# EAGLE schematic Antenna Board v4.1 (EAGLE 9.6.2)
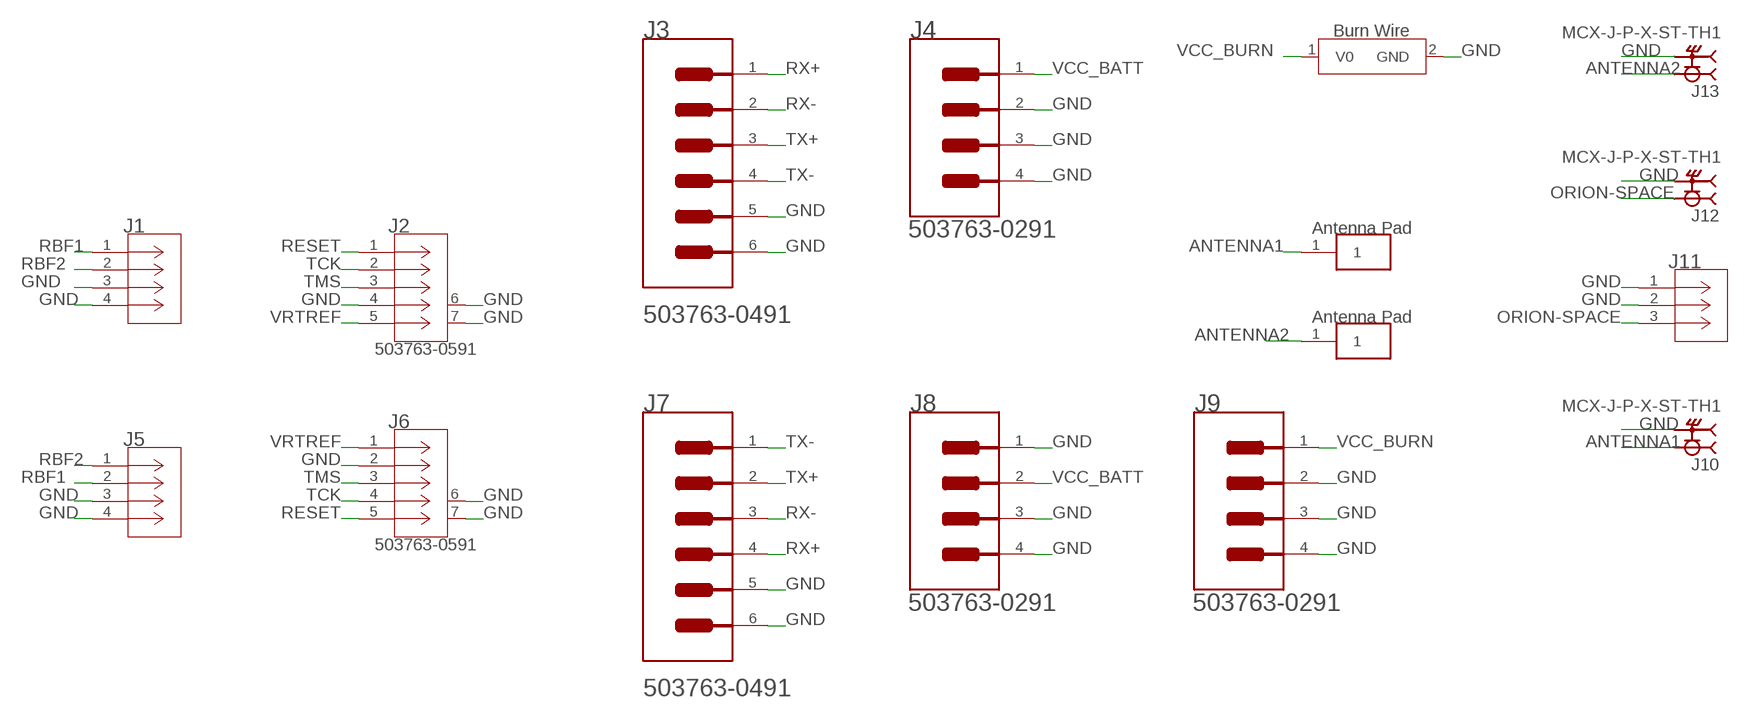
[diagram p0: schematic, sheet 1]

## Parts
J1  5037630291  [CON_5037630291]
J2  503763-0591  [CONN_5037630591_MOL]
J3  MOLEX_503763-0491MOLEX_503763-0491_0_0  [MOLEX_503763-0491_0]
J4  MOLEX_503763-0291MOLEX_503763-0291_0_0  [MOLEX_503763-0291_0]
J5  5037630291  [CON_5037630291]
J6  503763-0591  [CONN_5037630591_MOL]
J7  MOLEX_503763-0491MOLEX_503763-0491_0_0  [MOLEX_503763-0491_0]
J8  MOLEX_503763-0291MOLEX_503763-0291_0_0  [MOLEX_503763-0291_0]
J9  MOLEX_503763-0291MOLEX_503763-0291_0_0  [MOLEX_503763-0291_0]
J10  MCX-J-P-X-ST-TH1  [SAMTEC_MCX-J-P-X-ST-TH1]
J11  U.FL-R-SMT-1(01)  [CONN_-SMT-1(01)]
J12  MCX-J-P-X-ST-TH1  [SAMTEC_MCX-J-P-X-ST-TH1]
J13  MCX-J-P-X-ST-TH1  [SAMTEC_MCX-J-P-X-ST-TH1]
U$1  ANTENNA_PAD+HOLES  [ANTENNA_PAD+HOLES]
U$2  ANTENNA_PAD+HOLES  [ANTENNA_PAD+HOLES]
U$3  BURNWIRE  [BURNWIRE]

## Nets
ANTENNA1: J10.1 U$1.1
ANTENNA2: J13.1 U$2.1
GND: J1.3 J1.4 J2.4 J2.6 J2.7 J3.5(MNT_1) J3.6(MNT_2) J4.2 J4.3(MNT_1) J4.4(MNT_2) J5.3 J5.4 J6.2 J6.6 J6.7 J7.5(MNT_1) J7.6(MNT_2) J8.1 J8.3(MNT_1) J8.4(MNT_2) J9.2 J9.3(MNT_1) J9.4(MNT_2) J10.S1 J10.S2 J10.S3 J10.S4 J11.1 J11.2 J12.S1 J12.S2 J12.S3 J12.S4 J13.S1 J13.S2 J13.S3 J13.S4 U$3.2(GND)
ORION-SPACE: J11.3 J12.1
RBF1: J1.1 J5.2
RBF2: J1.2 J5.1
RESET: J2.1 J6.5
RX+: J3.1 J7.4
RX-: J3.2 J7.3
TCK: J2.2 J6.4
TMS: J2.3 J6.3
TX+: J3.3 J7.2
TX-: J3.4 J7.1
VCC_BATT: J4.1 J8.2
VCC_BURN: J9.1 U$3.1(V0)
VRTREF: J2.5 J6.1

## Library data of the parts
J1 J5 = Molex_503763-0291:5037630291; BUILT_BY: Molex_Team; COPYRIGHT: Copyright (C) 2018 Accelerated Designs. All rights reserved; MANUFACTURER_PART_NUMBER: 5037630291; SOURCELIBRARY: Add_to_database_2021-03-17; VENDOR: Molex Connector Corporation
J2 J6 = Molex - 503763-0591:503763-0591; BUILT_BY: EMA_Cory; COPYRIGHT: Copyright (C) 2018 Accelerated Designs. All rights reserved; DATASHEET: https://www.molex.com/pdm_docs/sd/5037630591_sd.pdf; MANUFACTURER_PART_NUMBER: 503763-0591; SOURCELIBRARY: Add_to_database_2020-12-14; VENDOR: Molex Connector Corporation
J3 J7 = Molex - 503763-0491:MOLEX_503763-0491: Wire-To-Board Connector, Pico-Lock 503763 Series, Surface Mount, Header, 4 Contacts, 1 mm; AUTOMOTIVE: No; CENTROID_NOT_SPECIFIED: No; CONN_GENDER: Male; CONN_ORIENTATION: Right Angle; CONTACT_MATERIAL: Gold,Nickel; CURRENT_RATING: 1.5A; DATASHEET: https://www.molex.com/webdocs/datasheets/pdf/en-us/5037630491_PCB_HEADERS.pdf; DEVICE_CLASS_L1: Connectors; DEVICE_CLASS_L2: Headers and Wire Housings; DEVICE_CLASS_L3: unset; DIGIKEY_DESCRIPTION: CONN HEADER 1MM R/A 4CKT; DIGIKEY_PART_NUMBER: WM10655CT-ND; FOOTPRINT_URL: https://www.molex.com/pdm_docs/sd/5037630491_sd.pdf; FOOTPRINT_VARIANT_NAME_0: Recommended_Land_Pattern; HEIGHT: 1.7mm; LEAD_FREE: Yes; MF: Molex; MFG_PACKAGE_IDENT: 503763-0491; MFG_PACKAGE_IDENT_DATE: 0; MFG_PACKAGE_IDENT_REV: 0; MOUSER_PART_NUMBER: 538-503763-0491; MPN: 503763-0491; NUMBER_OF_CONTACTS: 4; NUMBER_OF_ROWS: 1; PACKAGE: HDR4; PITCH: 1mm; PREFIX: J; ROHS: Yes; TEMPERATURE_RANGE_HIGH: +105°C; TEMPERATURE_RANGE_LOW: -40°C; VERIFICATION_VERSION: 0.0.0.1; VOLTAGE_RATING: 150V
J4 J8 J9 = Molex - 503763-0291:MOLEX_503763-0291: 2 Positions Header Connector 0.039" (1.00mm) Surface Mount, Right Angle Gold; CENTROID_NOT_SPECIFIED: No; DATASHEET: http://www.molex.com/pdm_docs/sd/5037630291_sd.pdf; DIGIKEY_DESCRIPTION: CONN HEADER 1MM R/A 2CKT; DIGIKEY_PART_NUMBER: WM10654CT-ND; LEAD_FREE: yes; MF: Molex; MOUSER_PART_NUMBER: 538-503763-0291; MPN: 503763-0291; PACKAGE: HDR02; PREFIX: J; ROHS: yes; TEMPERATURE_RANGE_HIGH: +105°C; TEMPERATURE_RANGE_LOW: -40°C
J10 J12 J13 = MCX-J-P-X-ST-TH1:MCX-J-P-X-ST-TH1: 50 Ohm MCX Jack or Plug, Through-hole; DESCRIPTION: MCX Connector Jack, Female Socket 50Ohm Through Hole Solder; DIGI-KEY_PART_NUMBER: SAM8944-ND; MF: Samtec; MP: MCX-J-P-H-ST-TH1; PACKAGE: None; PURCHASE-URL: https://pricing.snapeda.com/search/part/MCX-J-P-H-ST-TH1/?ref=eda
J11 = U.FL-R-SMT-1(01):U.FL-R-SMT-1(01); BUILT_BY: EMA_Matt; COPYRIGHT: Copyright (C) 2018 Accelerated Designs. All rights reserved; MANUFACTURER_PART_NUMBER: U.FL-R-SMT-1(01); SOURCELIBRARY: Hirose_12_20_2019; VENDOR: Hirose
U$1 U$2 = Antenna_Pad:ANTENNA_PAD+HOLES
U$3 = Burn_Wire:BURNWIRE